# EAGLE design SEN00001 (EAGLE 6.4)
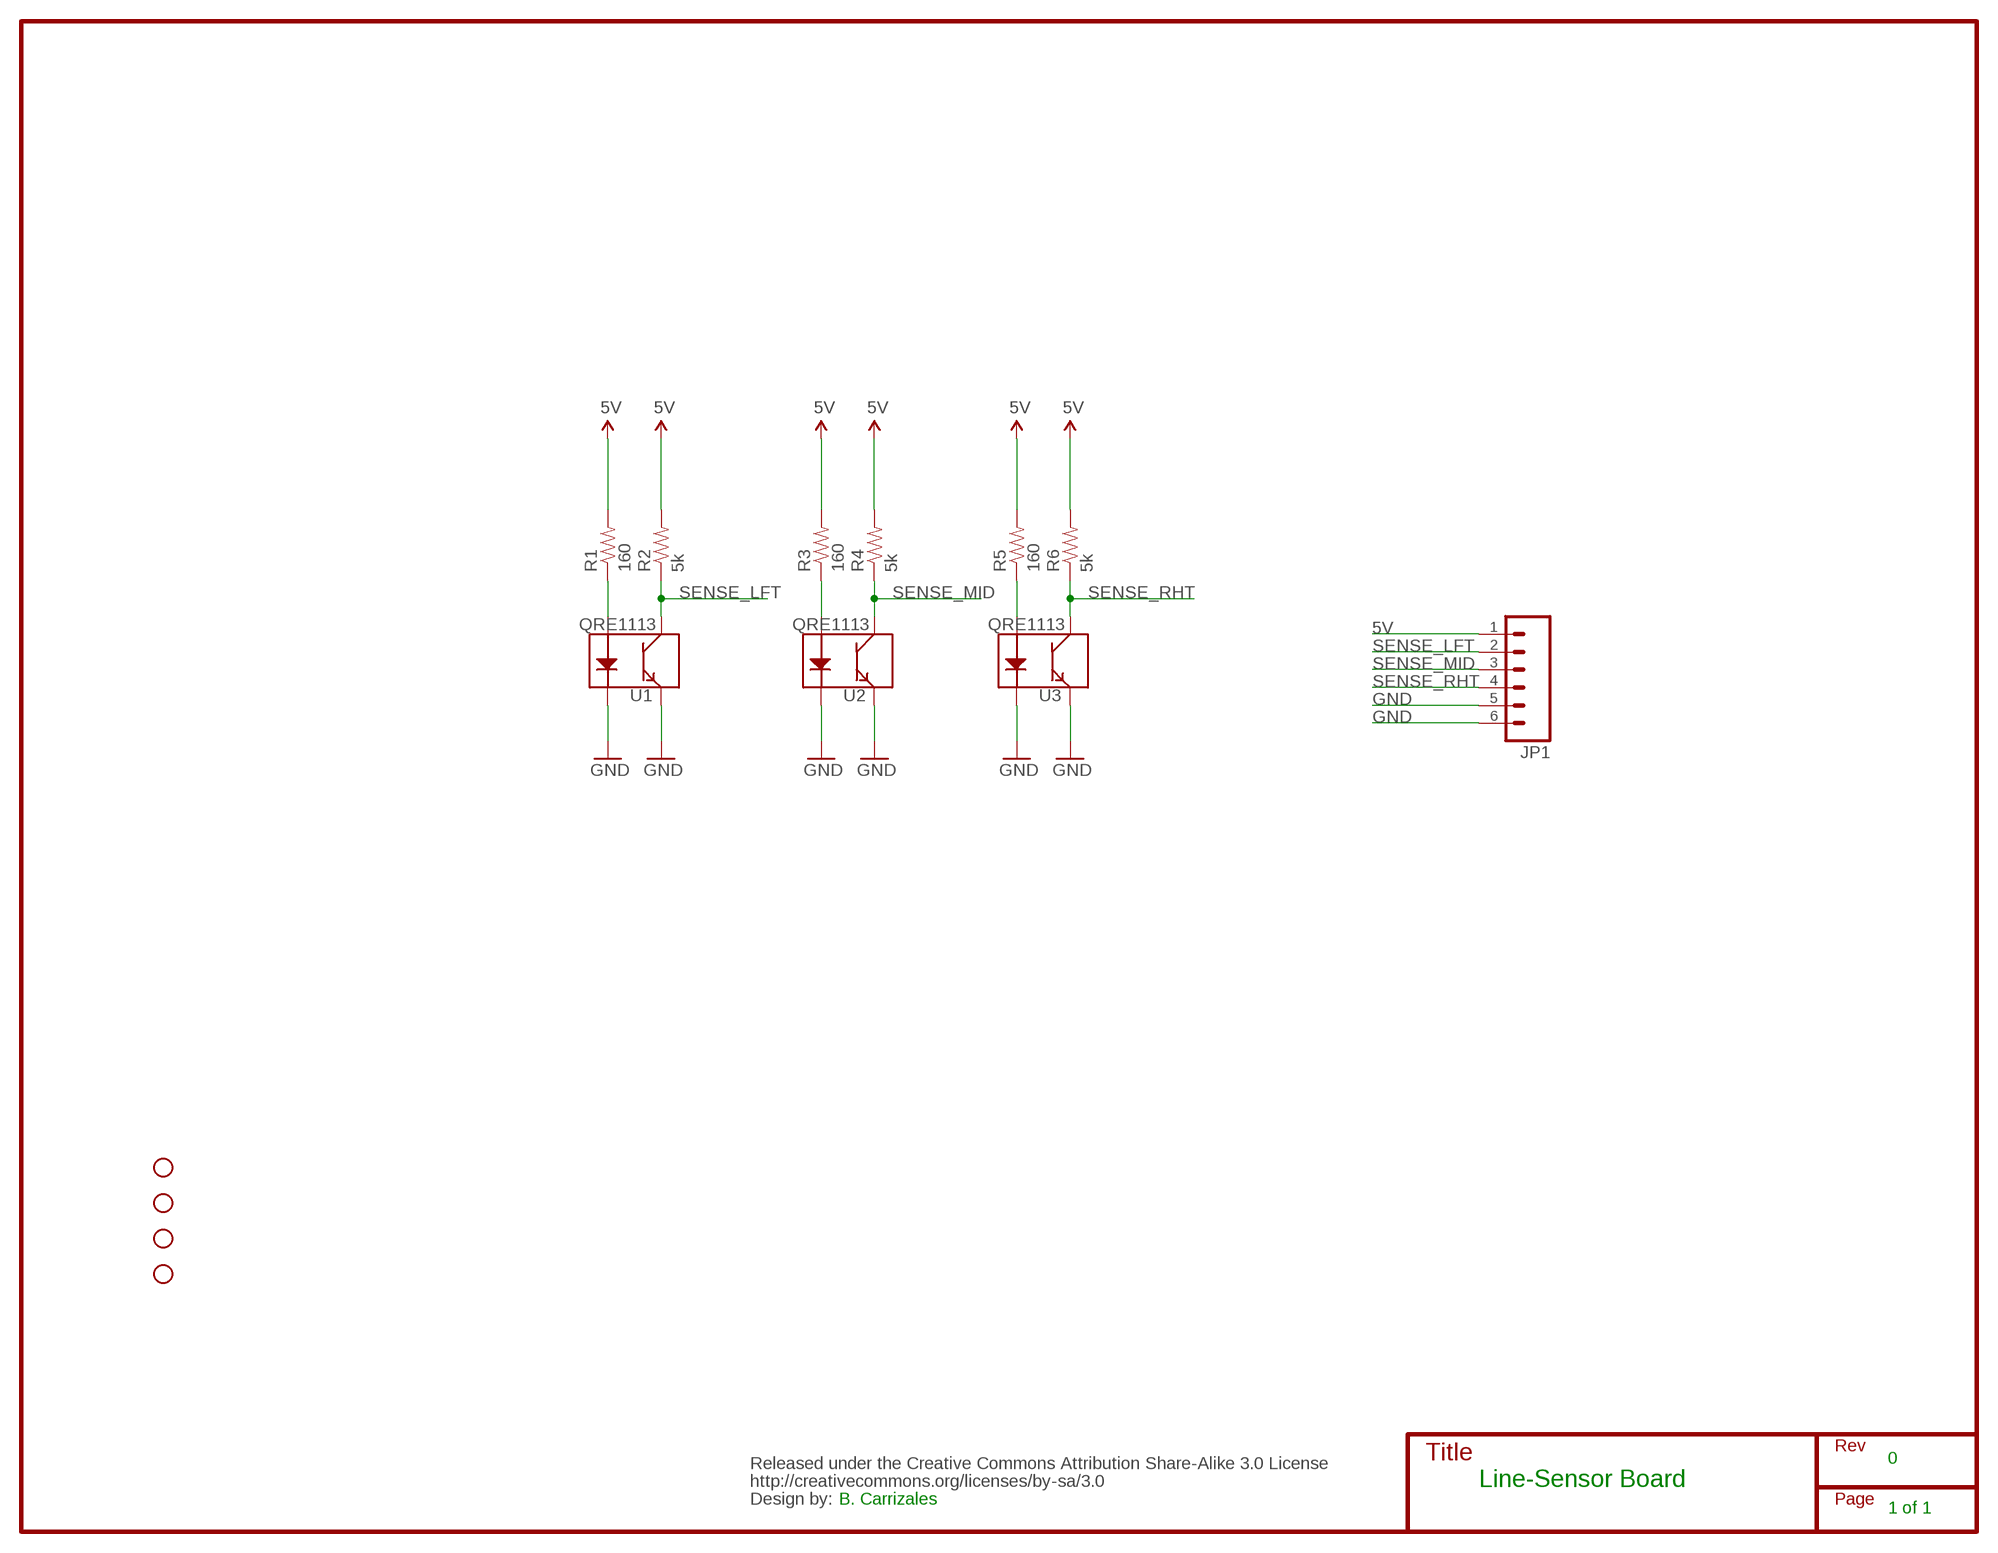
[diagram p0: schematic, sheet 1]

## Parts
CC_TEXT1  CREATIVE_COMMONS  [CREATIVE_COMMONS]
JP1  M06SIP  [1X06]
R1  160  RESISTOR0603  [0603-RES]
R2  5k  RESISTOR0603  [0603-RES]
R3  160  RESISTOR0603  [0603-RES]
R4  5k  RESISTOR0603  [0603-RES]
R5  160  RESISTOR0603  [0603-RES]
R6  5k  RESISTOR0603  [0603-RES]
STANDOFF1  STAND-OFF  [STAND-OFF]
STANDOFF2  STAND-OFF  [STAND-OFF]
STANDOFF3  STAND-OFF  [STAND-OFF]
STANDOFF4  STAND-OFF  [STAND-OFF]
U1  QRE1113  [QRE1113]
U2  QRE1113  [QRE1113]
U3  QRE1113  [QRE1113]

## Nets
5V: JP1.1 R1.2 R2.2 R3.2 R4.2 R5.2 R6.2
GND: JP1.5 JP1.6 U1.2(K) U1.4(E) U2.2(K) U2.4(E) U3.2(K) U3.4(E)
N$2: R5.1 U3.1(A)
N$4: R3.1 U2.1(A)
N$6: R1.1 U1.1(A)
SENSE_LFT: JP1.2 R2.1 U1.3(C)
SENSE_MID: JP1.3 R4.1 U2.3(C)
SENSE_RHT: JP1.4 R6.1 U3.3(C)

## Notes on the sheet
- 0
- Line-Sensor Board
- B. Carrizales
- 1 of 1

## Library data of the parts
CC_TEXT1 = SparkFun-Aesthetics:CREATIVE_COMMONS: Creative Commons License summary
JP1 = SparkFun-Connectors:M06: Header 6 Standard 6-pin 0.1" header. Use with straight break away headers (SKU : PRT-00116), right angle break away headers (PRT-00553), swiss pins (PRT-00743), machine pins (PRT-00117), and female headers (PRT-00115). Molex polarized connector foot print use with SKU : PRT-08094 with associated crimp pins and housings. NOTES ON THE VARIANTS LOCK and LOCK_LONGPADS... This footprint was designed to help hold the alignment of a through-hole component (i.e. 6-pin header) while soldering it into place. You may notice that each hole has been shifted either up or down by 0.005 of an inch from it's more standard position (which is a perfectly straight line). This slight alteration caused the pins (the squares in the middle) to touch the edges of the holes. Because they are alternating, it causes a "brace" to hold the component in place. 0.005 has proven to be the perfect amount of "off-center" position when using our standard breakaway headers. Although looks a little odd when you look at the bare footprint, once you have a header in there, the alteration is very hard to notice. Also,if you push a header all the way into place, it is covered up entirely on the bottom side. This idea of altering the position of holes to aid alignment will be further integrated into the Sparkfun Library for other footprints. It can help hold any component with 3 or more connection pins.
R1-R6 = SparkFun-Resistors:RESISTOR: Resistor Basic schematic elements and footprints for 0603, 1206, and PTH resistors.
STANDOFF1-STANDOFF4 = SparkFun-Electromechanical:STAND-OFF: #4 Stand Off This is the mechanical footprint for a #4 phillips button head screw. Use the keepout ring to avoid running the screw head into surrounding components. SKU : PRT-00447
U1-U3 = SparkFun-Sensors:QRE1113: Reflective object sensor; PROD_ID: IC-09357

## Board
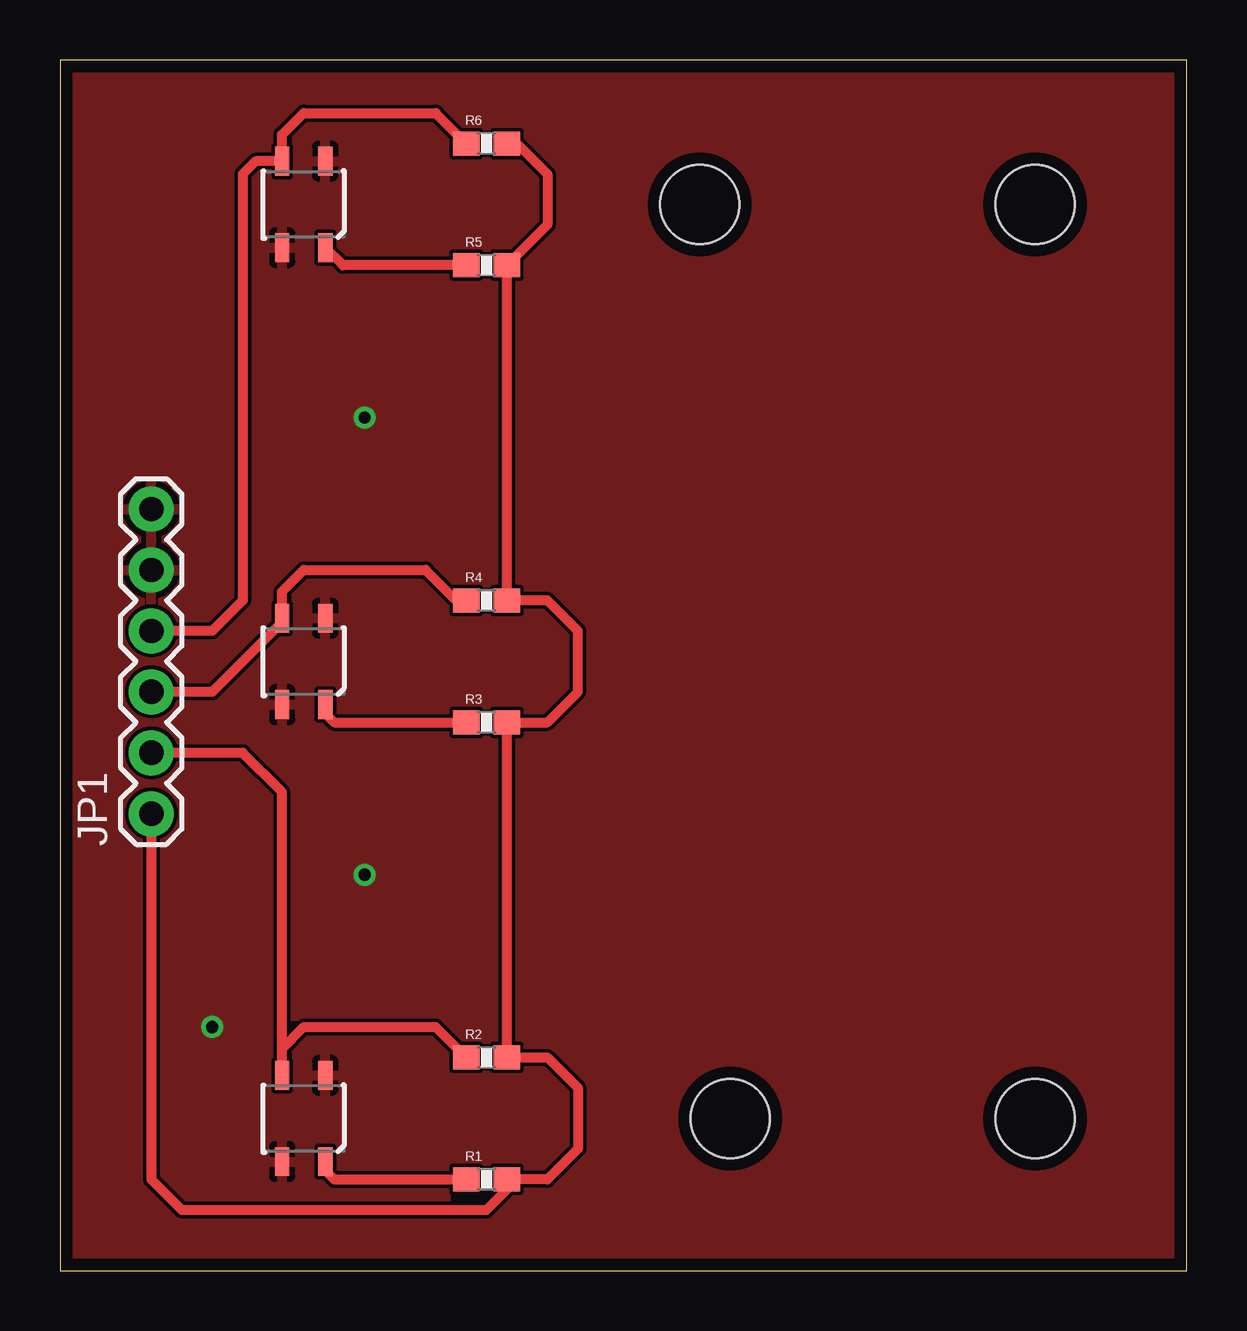
[diagram p1: board, top side]
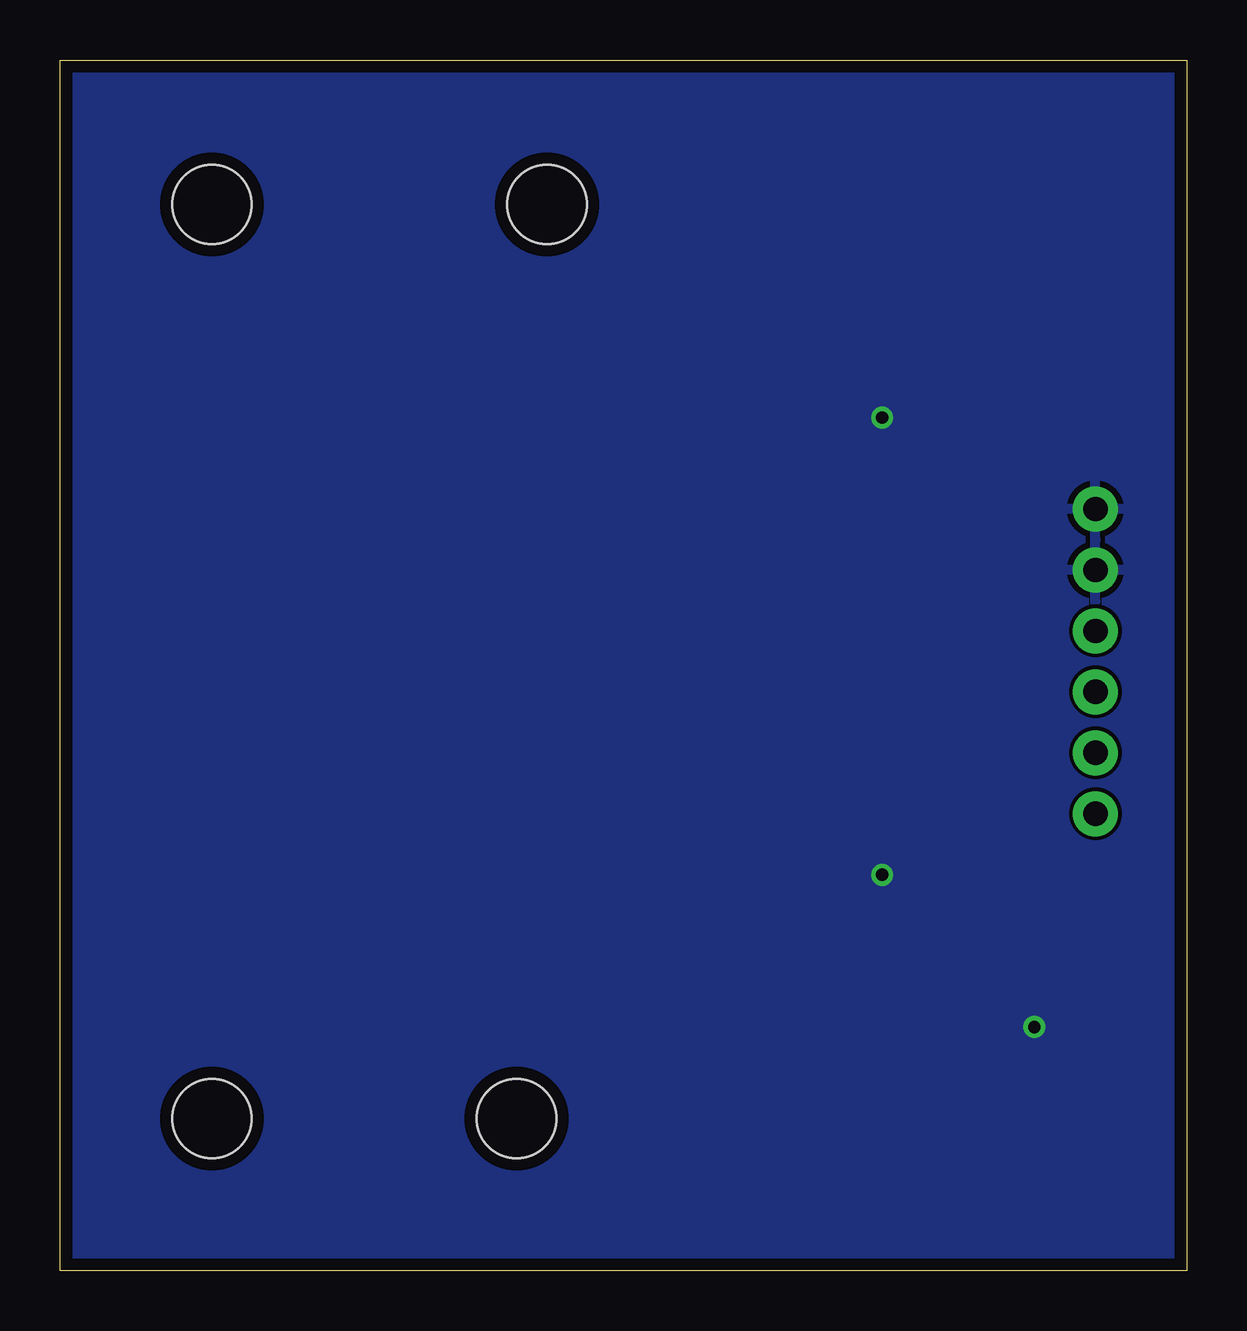
[diagram p2: board, bottom side, seen from below]

Size 46.97 x 50.47 mm. Coordinates in mm from the lower left corner, seen from the top.
Outline: 0,0 46.97,0 46.97,50.47 0,50.47 0,0
Copper layers (1*16): Top 0.0178mm / dielectric 59mil / Bottom 0.0178mm
Design rules "SSC-EAGLE-2Lyr_v1.0.0.3": minimum track width 6mil, minimum drill 14mil, track to track 6mil, track to pad 6mil, pad to pad 6mil, via to via 6mil, smd to smd 6mil, copper to edge 20mil, drill to drill 16mil, minimum pad ring 8mil, minimum via ring 8mil, stop-mask expansion 3mil, vias tented up to drill 0mil, thermal gap 10mil

### Footprints (pad centres in the part's own frame; a part is rotated, then mirrored left to right if it is on the bottom)
1X06 = drill 1.016 pad 1.88: 1 0,0; 2 2.54,0; 3 5.08,0; 4 7.62,0; 5 10.16,0; 6 12.7,0
0603-RES = smd 1.1 x 1: 1 -0.85,0; 2 0.85,0
STAND-OFF = hole 3.302: 0,0
QRE1113 = smd 1.2 x 0.6: 1 -1.8,-0.9; 2 1.8,-0.9; 3 1.8,0.9; 4 -1.8,0.9

### Placement (x,y rotation side)
CC_TEXT1  5.08,-10.16 0 top  (outside the outline)
JP1  3.81,19.05 90 top
R1  17.78,3.81 0 top
R2  17.78,8.89 0 top
R3  17.78,22.86 0 top
R4  17.78,27.94 0 top
R5  17.78,41.91 0 top
R6  17.78,46.99 0 top
STANDOFF1  27.94,6.35 0 top
STANDOFF2  26.67,44.45 0 top
STANDOFF3  40.64,6.35 0 top
STANDOFF4  40.64,44.45 0 top
U1  10.16,6.35 90 top
U2  10.16,25.4 90 top
U3  10.16,44.45 90 top

### Tracks (layer width: path | path; a pad name or v marks a point on that pad's centre or on a via)
5V
  Top 0.406: R6.2 19.05,46.99 20.32,45.72 20.32,43.6 R5.2 R4.2 20.32,27.94 21.59,26.67 21.59,24.13 20.32,22.86 R3.2 R2.2 20.32,8.89 21.59,7.62 21.59,5.08 20.32,3.81 19.05,3.81 | JP1.1 3.81,3.81 5.08,2.54 17.78,2.54 19.05,3.81 | 19.05,3.81 R1.2
GND  (via drill 0.51)
  other vias: 12.7,35.56 12.7,16.51 6.35,10.16
  pour Top: 0,50.8 0,0 46.99,0 46.99,50.8
  pour Bottom: 0,49.53 0,0 46.99,0 46.99,50.8 0,50.8
N$2
  Top 0.406: R5.1 11.8,41.91 U3.1
N$4
  Top 0.406: U2.1 11.06,23.23 11.43,22.86 R3.1
N$6
  Top 0.406: U1.1 11.06,4.18 11.43,3.81 R1.1
SENSE_LFT
  Top 0.406: JP1.2 7.62,21.59 9.26,19.95 U1.3 9.26,9.26 10.16,10.16 15.66,10.16 R2.1
SENSE_MID
  Top 0.406: R4.1 16.51,27.94 15.24,29.21 10.16,29.21 9.26,28.31 U2.3 9.26,27.04 6.35,24.13 JP1.3
SENSE_RHT
  Top 0.406: R6.1 15.66,48.26 10.16,48.26 9.26,47.36 U3.3 8.15,46.25 7.62,45.72 7.62,27.94 6.35,26.67 JP1.4

### Text on the board
tDocu: B. Carrizales